# EAGLE design dmx-featherwing-v1 (EAGLE 7.7.0)
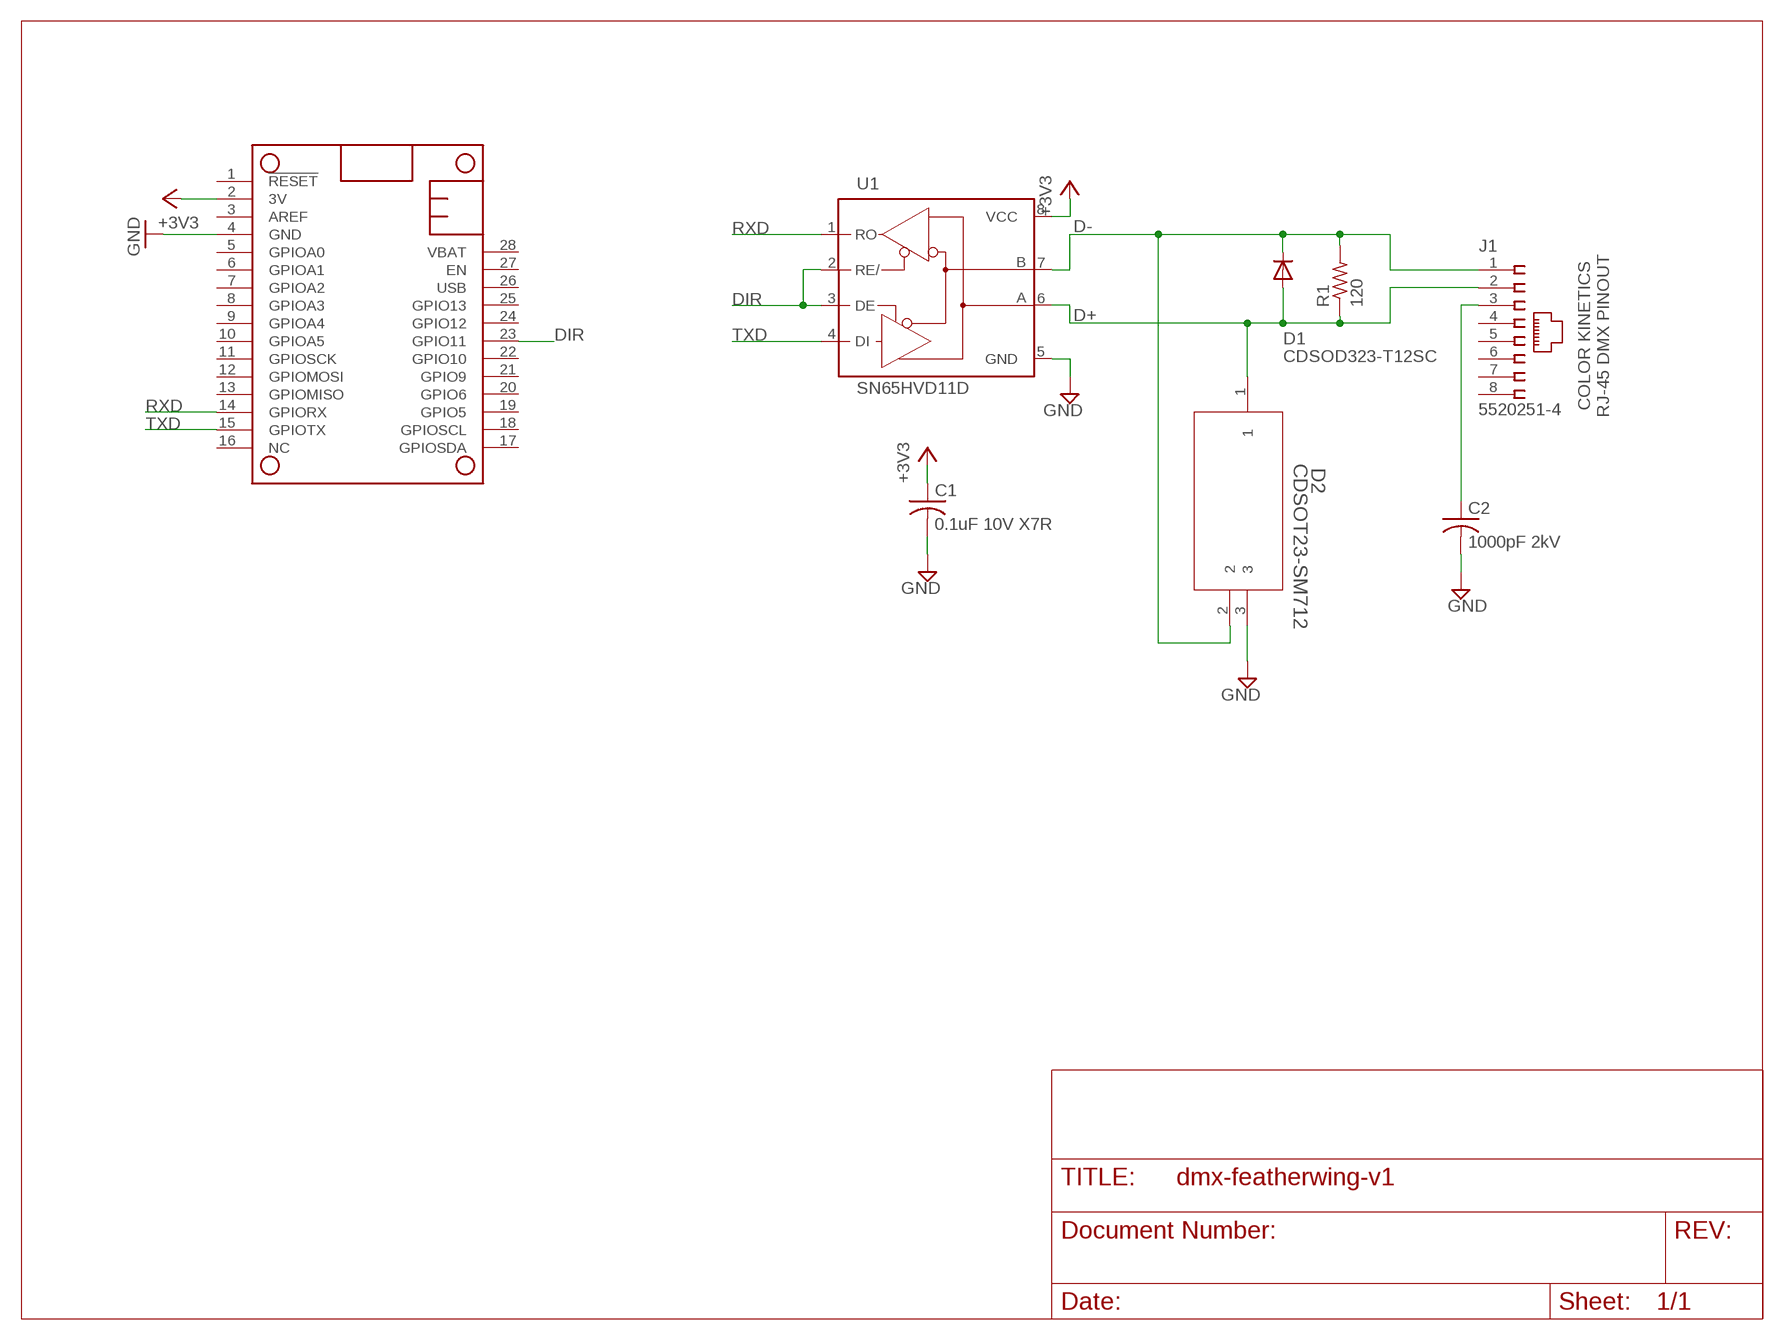
[diagram p0: schematic, sheet 1]

## Parts
C1  0.1uF 10V X7R  C-USC0805  [C0805]
C2  1000pF 2kV  C-USC1206K  [C1206K]
D1  CDSOD323-T12SC  DIODE-SOD323-W  [SOD323-W]
D2  CDSOT23-SM712  [SOT_SM712]
J1  5520251-4  [5520251-4]
MS2  FEATHERWING  [FEATHERWING]
R1  120  R-US_R0805  [R0805]
U1  SN65HVD11D  MAX3468CSA  [SO08]

## Nets
+3V3: C1.1 MS2.2(3V) U1.8(VCC)
D+: D1.A D2.1 J1.2 R1.1 U1.6(A)
D-: D1.C D2.2 J1.1 R1.2 U1.7(B)
DIR: MS2.23(GPIO11) U1.2(RE/) U1.3(DE)
GND: C1.2 C2.2 D2.3 MS2.4(GND) U1.5(GND)
N$1: C2.1 J1.3
RXD: MS2.14(GPIORX) U1.1(RO)
TXD: MS2.15(GPIOTX) U1.4(DI)
Unconnected: J1.4 J1.5 J1.6 J1.7 J1.8 MS2.1(!RESET) MS2.3(AREF) MS2.5(GPIOA0) MS2.6(GPIOA1) MS2.7(GPIOA2) MS2.8(GPIOA3) MS2.9(GPIOA4) MS2.10(GPIOA5) MS2.11(GPIOSCK) MS2.12(GPIOMOSI) MS2.13(GPIOMISO) MS2.16(NC) MS2.17(GPIOSDA) MS2.18(GPIOSCL) MS2.19(GPIO5) MS2.20(GPIO6) MS2.21(GPIO9) MS2.22(GPIO10) MS2.24(GPIO12) MS2.25(GPIO13) MS2.26(USB) MS2.27(EN) MS2.28(VBAT)

## Notes on the sheet
- COLOR KINETICS
  RJ-45 DMX PINOUT

## Library data of the parts
C1 C2 = rcl:C-US: CAPACITOR, American symbol
D1 = diode:DIODE-: DIODE
D2 = CDSOT23-SM712:CDSOT23-SM712; BUILT_BY: EMA_Matt; MANUFACTURER_PART_NUMBER: CDSOT23-SM712; VENDOR: Bourns Electronics
J1 = TE 5520251-4:5520251-4
MS2 = microbuilder:FEATHERWING
R1 = rcl:R-US_: RESISTOR, American symbol
U1 = maxim:MAX34*: +5V, Fail-Safe, 40Mbps, Profibus RS-485/RS-422 Transceivers Source: MAX3465-MAX3469.pdf; MPN: MAX3468CSA+; OC_FARNELL: unknown; OC_NEWARK: 76K6721

## Board
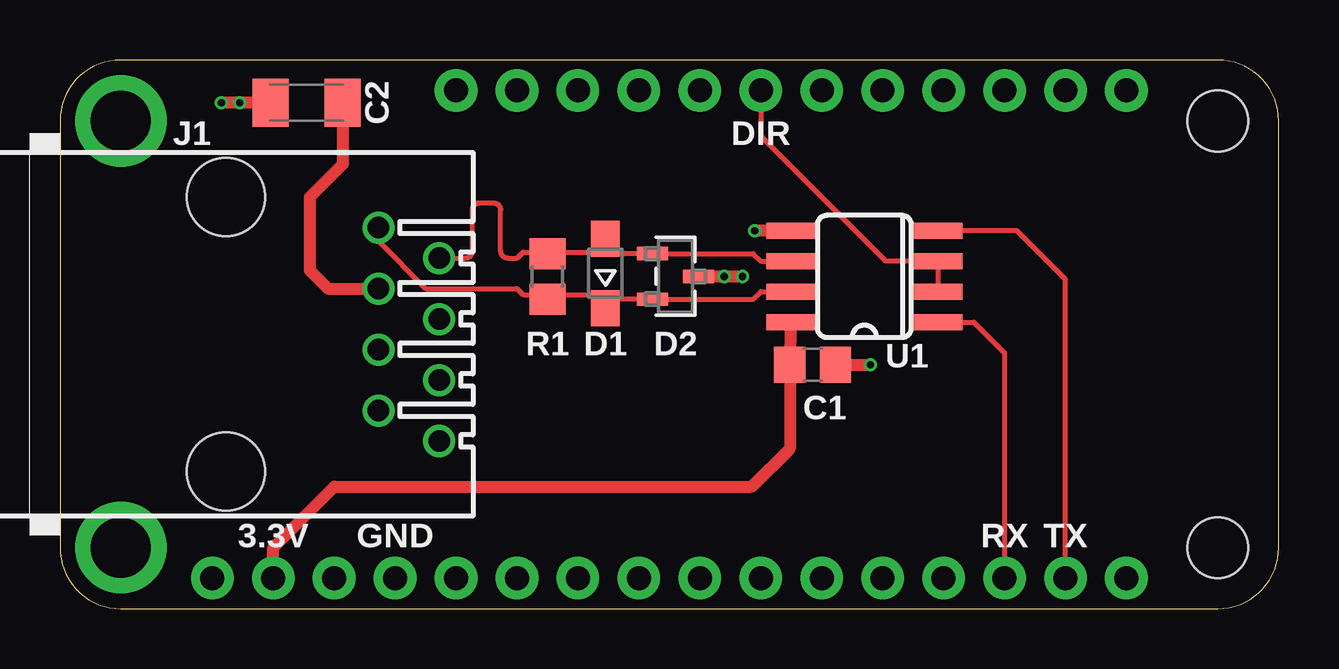
[diagram p1: board, top side]
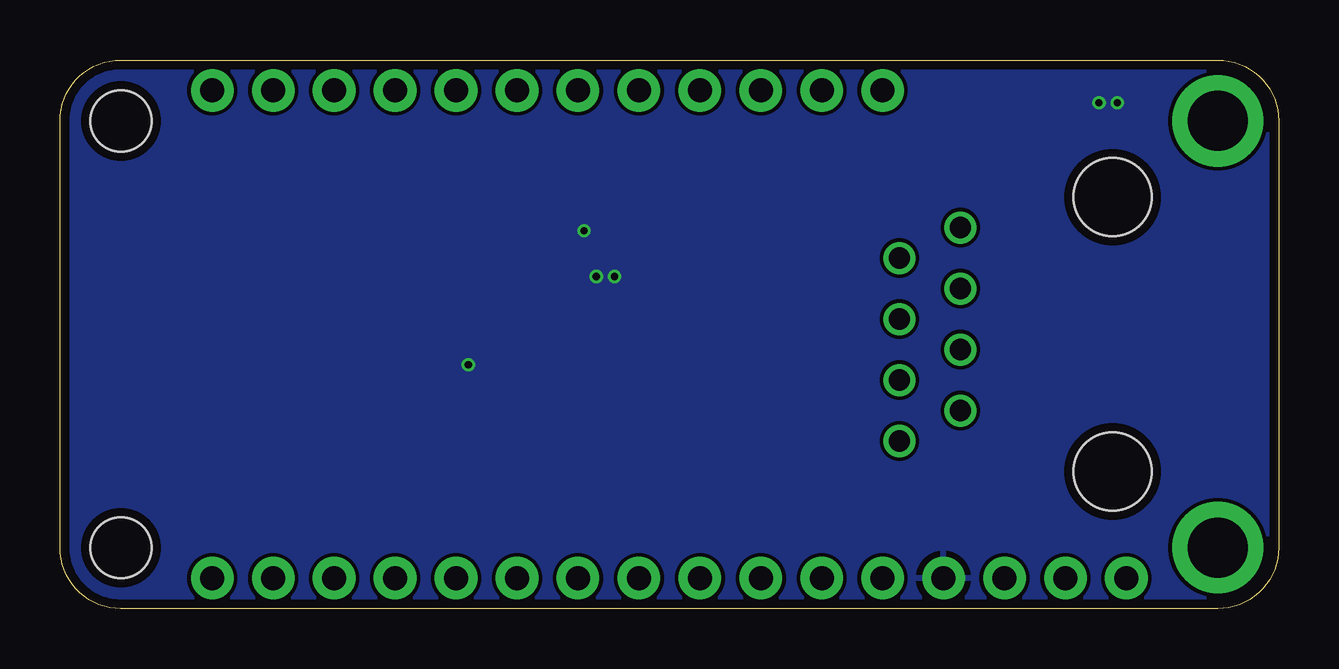
[diagram p2: board, bottom side, seen from below]

Size 50.8 x 22.86 mm. Coordinates in mm from the lower left corner, seen from the top.
Copper layers (1*16): Top 0.035559375mm / dielectric 1.6mm / Bottom 0.035559375mm
Design rules "oshpark-2layer-2018": minimum track width 6mil, minimum drill 10mil, track to track 6mil, track to pad 6mil, pad to pad 6mil, via to via 6mil, smd to smd 6mil, copper to edge 15mil, drill to drill 6mil, minimum pad ring 5mil, minimum via ring 5mil, stop-mask expansion 2.5mil, vias tented up to drill 0mil, thermal gap 10mil

### Footprints (pad centres in the part's own frame; a part is rotated, then mirrored left to right if it is on the bottom)
C0805 = smd 1.3 x 1.5: 1 -0.95,0; 2 0.95,0
C1206K = smd 1.5 x 2: 1 -1.5,0; 2 1.5,0
SOD323-W = smd 1.5 x 1.2: A 1.45,0; C -1.45,0
SOT_SM712 = smd 0.559 x 1.295: 1 -0.95,-0.953; 2 0.95,-0.953; 3 0,0.953
5520251-4 = drill 0.889: 1 -4.445,6.35; 2 -3.175,8.89; 3 -1.905,6.35; 4 -0.635,8.89; 5 0.635,6.35; 6 1.905,8.89; 7 3.175,6.35; 8 4.445,8.89 | hole 3.251: -5.715,0; 5.715,0
FEATHERWING = drill 1 pad 1.778: 1 6.35,1.27; 2 8.89,1.27; 3 11.43,1.27; 4 13.97,1.27; 5 16.51,1.27; 6 19.05,1.27; 7 21.59,1.27; 8 24.13,1.27; 9 26.67,1.27; 10 29.21,1.27; 11 31.75,1.27; 12 34.29,1.27; 13 36.83,1.27; 14 39.37,1.27; 15 41.91,1.27; 16 44.45,1.27; 17 44.45,21.59; 18 41.91,21.59; 19 39.37,21.59; 20 36.83,21.59; 21 34.29,21.59; 22 31.75,21.59; 23 29.21,21.59; 24 26.67,21.59; 25 24.13,21.59; 26 21.59,21.59; 27 19.05,21.59; 28 16.51,21.59 | drill 2.5 pad 3.81: P$1 2.54,20.32; P$2 2.54,2.54 | hole 2.54: 48.26,20.32; 48.26,2.54
R0805 = smd 1.3 x 1.5: 1 -0.95,0; 2 0.95,0
SO08 = smd 0.66 x 2.032: 1 -1.905,-3.073; 2 -0.635,-3.073; 3 0.635,-3.073; 4 1.905,-3.073; 5 1.905,3.073; 6 0.635,3.073; 7 -0.635,3.073; 8 -1.905,3.073

### Placement (x,y rotation side)
C1  31.37,10.16 0 top
C2  10.29,21.08 180 top
D1  22.73,13.97 90 top
D2  25.65,13.84 270 top
J1  6.92,11.43 270 top
MS2  0,0 0 top
R1  20.32,13.84 270 top
U1  33.53,13.84 90 top

### Tracks (layer width: path | path; a pad name or v marks a point on that pad's centre or on a via)
+3V3
  Top 0.508: U1.8 C1.1 30.42,6.67 28.83,5.08 11.43,5.08 8.89,2.54 MS2.2
D+
  Top 0.203: J1.2 16.89,14.61 arc90 17.18,14.9 17.18,16.6 arc-90 17.48,16.89 18.08,16.89 arc-90 18.37,16.6 18.37,14.9 arc90 18.67,14.61 19.05,14.61 19.3,14.86 20.32,14.86 22.17,14.86 D1.A 23.36,14.79 D2.1 28.89,14.79 29.21,14.48 U1.6
  Top 0.508: R1.1 20.32,14.86
D-
  Top 0.203: J1.1 13.27,15.3 15.24,13.34 19.05,13.34 19.3,13.08 20.32,13.08 22.17,13.08 D1.C 23.11,12.89 D2.2 28.89,12.89 29.21,13.21 U1.7
  Top 0.508: R1.2 20.32,13.08
DIR
  Top 0.203: U1.2 U1.3 34.42,14.48 29.21,19.68 MS2.23
GND  (via drill 0.3)
  Top 0.508: U1.5 v28.96,15.75 | C1.2 v33.78,10.16 | D2.3 v27.69,13.84 v28.45,13.84 | C2.2 v7.49,21.08 v6.73,21.08
  pour Bottom (isolate 0.152): 0,0 50.8,0 50.8,22.86 0,22.86
N$1
  Top 0.508: C2.1 11.79,18.52 10.41,17.14 10.41,14.1 11.18,13.34 J1.3
RXD
  Top 0.203: U1.1 38.1,11.94 39.37,10.67 MS2.14
TXD
  Top 0.203: MS2.15 41.91,13.72 39.88,15.75 U1.4

### Text on the board
_tsilk: C2 | DIR | J1 | R1 | D1 | D2 | U1 | C1 | 3.3V | GND | RX | TX